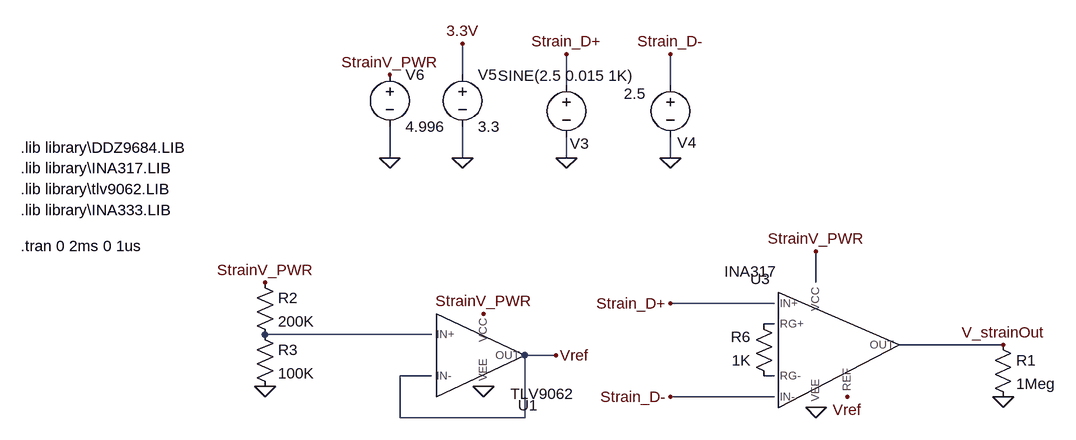
[diagram p0: schematic strainAmplifier.asc]
strainAmplifier.asc, the LTspice schematic file:
Version 4.1
SHEET 1 2284 1760
WIRE 1296 -640 1296 -688
WIRE 1456 -624 1456 -672
WIRE 1616 -624 1616 -672
WIRE 1184 -512 1184 -560
WIRE 1296 -512 1296 -560
WIRE 1456 -512 1456 -544
WIRE 1616 -512 1616 -544
WIRE 1840 -320 1840 -368
WIRE 1776 -288 1616 -288
WIRE 1776 -256 1760 -256
WIRE 1248 -240 992 -240
WIRE 2128 -224 1968 -224
WIRE 1440 -208 1392 -208
WIRE 1248 -176 1200 -176
WIRE 1776 -176 1760 -176
WIRE 1776 -144 1616 -144
WIRE 1200 -112 1200 -176
WIRE 1392 -112 1392 -208
WIRE 1392 -112 1200 -112
FLAG 1456 -672 Strain_D+
FLAG 1616 -672 Strain_D-
FLAG 1616 -288 Strain_D+
FLAG 1616 -144 Strain_D-
FLAG 1840 -368 StrainV_PWR
FLAG 1840 -128 0
FLAG 1456 -512 0
FLAG 1616 -512 0
FLAG 1296 -512 0
FLAG 1296 -688 3.3V
FLAG 1184 -512 0
FLAG 1184 -640 StrainV_PWR
FLAG 1440 -208 Vref
FLAG 1888 -144 Vref
FLAG 992 -320 StrainV_PWR
FLAG 992 -160 0
FLAG 1328 -272 StrainV_PWR
FLAG 1328 -160 0
FLAG 2128 -144 0
FLAG 2128 -224 V_strainOut
SYMBOL voltage 1456 -640 R0
WINDOW 0 20 90 Top 2
WINDOW 3 -1 17 Bottom 2
WINDOW 123 0 0 Left 0
WINDOW 39 0 0 Left 0
SYMATTR InstName V3
SYMATTR Value SINE(2.5 0.015 1K)
SYMBOL voltage 1616 -640 R0
WINDOW 0 25 89 Top 2
WINDOW 3 -55 45 Bottom 2
WINDOW 123 0 0 Left 0
WINDOW 39 0 0 Left 0
SYMATTR InstName V4
SYMATTR Value 2.5
SYMBOL res 1776 -160 R180
WINDOW 0 36 76 Left 2
WINDOW 3 36 40 Left 2
SYMATTR InstName R6
SYMATTR Value 1K
SYMBOL voltage 1296 -656 R0
WINDOW 123 0 0 Left 0
WINDOW 39 0 0 Left 0
SYMATTR InstName V5
SYMATTR Value 3.3
SYMBOL voltage 1184 -656 R0
WINDOW 123 0 0 Left 0
WINDOW 39 0 0 Left 0
SYMATTR InstName V6
SYMATTR Value 4.996
SYMBOL library\\INA317 1840 -224 R0
SYMATTR InstName U3
SYMBOL res 976 -336 R0
SYMATTR InstName R2
SYMATTR Value 200K
SYMBOL res 976 -256 R0
SYMATTR InstName R3
SYMATTR Value 100K
SYMBOL library\\TLV9062 1312 -208 R0
SYMATTR InstName U1
SYMBOL res 2112 -240 R0
SYMATTR InstName R1
SYMATTR Value 1Meg
TEXT 616 -496 Left 2 !.lib library\\INA317.LIB
TEXT 616 -464 Left 2 !.lib library\\tlv9062.LIB
TEXT 616 -432 Left 2 !.lib library\\INA333.LIB
TEXT 616 -376 Left 2 !.tran 0 2ms 0 1us
TEXT 616 -528 Left 2 !.lib library\\DDZ9684.LIB

The netlist it stands for:
* strainAmplifier.asc
V3 Strain_D+ 0 SINE(2.5 0.015 1K)
V4 Strain_D- 0 2.5
R6 N003 N001 1K
V5 3.3V 0 3.3
V6 StrainV_PWR 0 4.996
X§U3 Strain_D+ Strain_D- StrainV_PWR 0 V_strainOut Vref N001 N003 INA317  ; pins IN+ IN- VCC VEE OUT REF RG+ RG-
R2 StrainV_PWR N002 200K
R3 N002 0 100K
X§U1 N002 Vref StrainV_PWR 0 Vref TLV9062  ; pins IN+ IN- VCC VEE OUT
R1 V_strainOut 0 1Meg
.lib library\INA317.LIB
.lib library\tlv9062.LIB
.lib library\INA333.LIB
.tran 0 2ms 0 1us
.lib library\DDZ9684.LIB
.lib C:\Users\Parry\Documents\BCIT-BAJA\testing\LTSPICE_SIMS\library\INA317.LIB
.lib C:\Users\Parry\Documents\BCIT-BAJA\testing\LTSPICE_SIMS\library\tlv9062.LIB
.backanno
.end